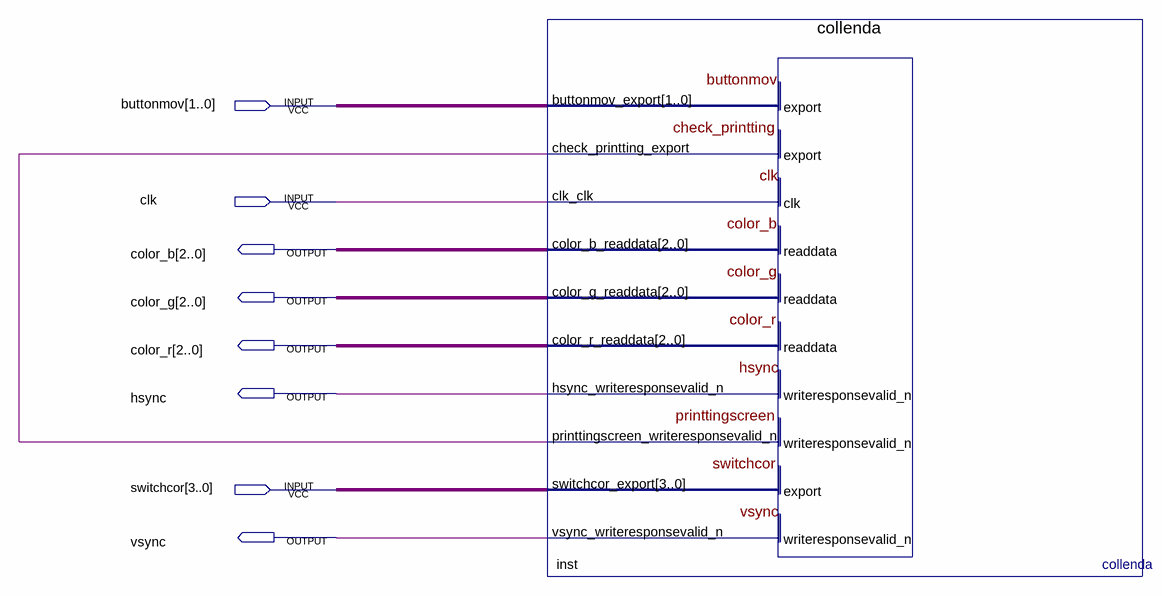
[diagram p0: schematic sheet]
// Quartus schematic ConsoleFPGA.bdf as structural Verilog: 1 symbols, 8 pins
module ConsoleFPGA (
  input  [1:0] buttonmov,
  input  clk,
  input  [3:0] switchcor,
  output [2:0] color_b,
  output [2:0] color_g,
  output [2:0] color_r,
  output hsync,
  output vsync
);

  wire inst_printtingscreen_writeresponsevalid_n;

  collenda inst (
    .buttonmov_export(buttonmov), .check_printting_export(inst_printtingscreen_writeresponsevalid_n),
    .clk_clk(clk), .switchcor_export(switchcor), .color_b_readdata(color_b), .color_g_readdata(color_g),
    .color_r_readdata(color_r), .hsync_writeresponsevalid_n(hsync),
    .printtingscreen_writeresponsevalid_n(inst_printtingscreen_writeresponsevalid_n),
    .vsync_writeresponsevalid_n(vsync));
endmodule
